# Altium schematic sheet fpga-wing.SchDoc
size A
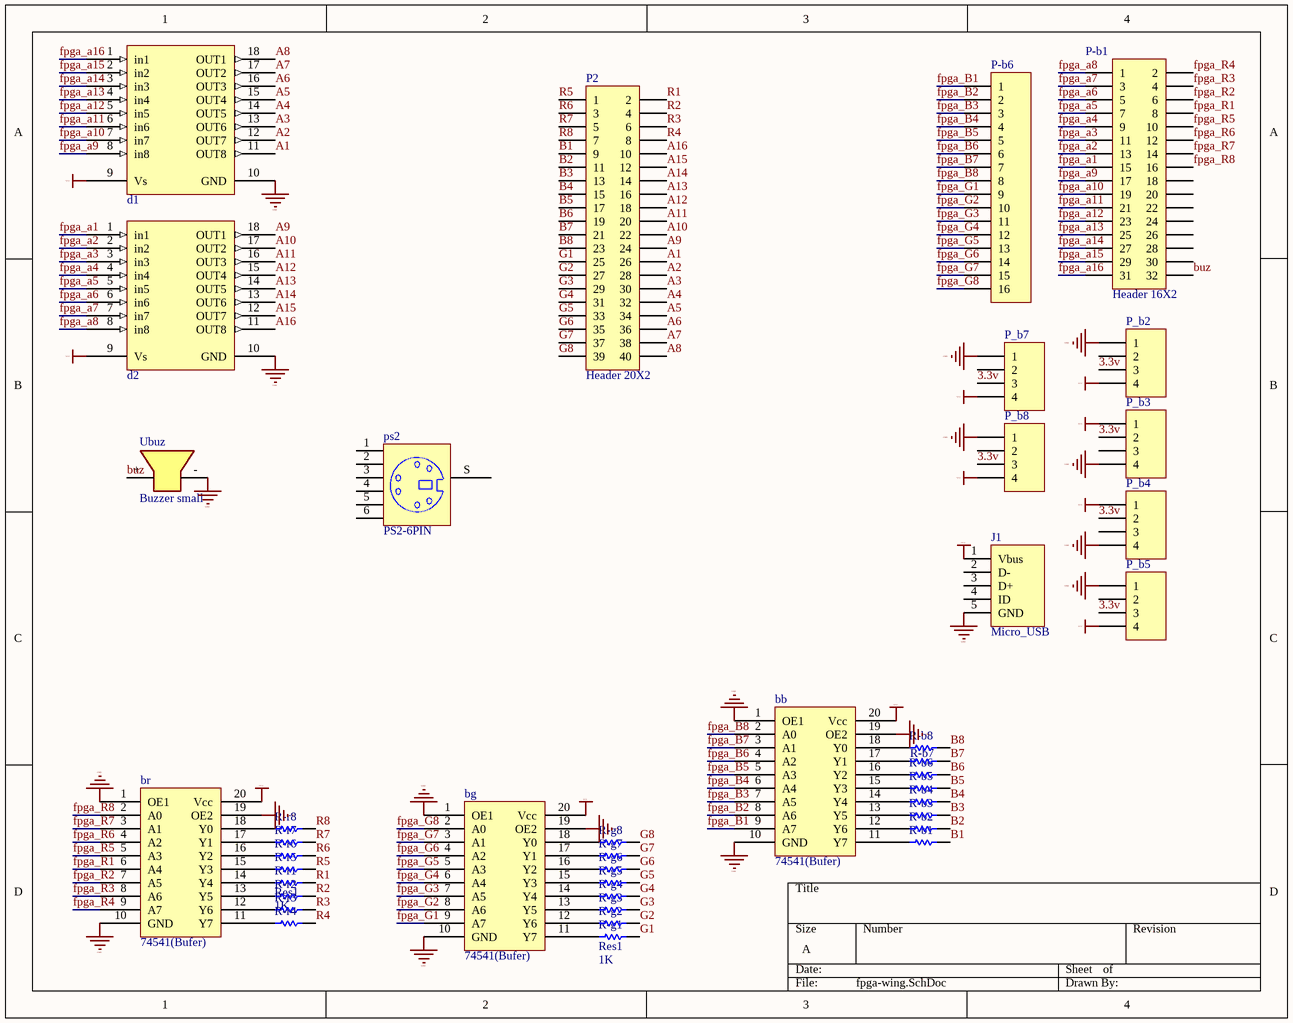
[diagram p0: fpga-wing.SchDoc]

## Parts
bb  74541(Bufer)  [SO20_M]
bg  74541(Bufer)  [SO20_M]
br  74541(Bufer)  [SO20_M]
d1  udn2981  [DIP18]  (value not drawn)
d2  udn2981  [DIP18]  (value not drawn)
J1  Micro_USB  [microUSB]
P2  Header 20X2  [HDR2X20]
P-b1  Header 16X2  [HDR2X16]
P-b6  Header 16  [My_1X16]  (value not drawn)
P_b2  Header 4  [My_1X04]  (value not drawn)
P_b3  Header 4  [My_1X04]  (value not drawn)
P_b4  Header 4  [My_1X04]  (value not drawn)
P_b5  Header 4  [My_1X04]  (value not drawn)
P_b7  Header 4  [My_1X04]  (value not drawn)
P_b8  Header 4  [My_1X04]  (value not drawn)
ps2  PS2-6PIN  [My_PS2-6PIN]
R-b1  Res1  [SMD_RES_1206]  (value not drawn)
R-b2  Res1  [SMD_RES_1206]  (value not drawn)
R-b3  Res1  [SMD_RES_1206]  (value not drawn)
R-b4  Res1  [SMD_RES_1206]  (value not drawn)
R-b5  Res1  [SMD_RES_1206]  (value not drawn)
R-b6  Res1  [SMD_RES_1206]  (value not drawn)
R-b7  Res1  [SMD_RES_1206]  (value not drawn)
R-b8  Res1  [SMD_RES_1206]  (value not drawn)
R-g1  Res1  value 1K  [SMD_RES_1206]
R-g2  Res1  [SMD_RES_1206]  (value not drawn)
R-g3  Res1  [SMD_RES_1206]  (value not drawn)
R-g4  Res1  [SMD_RES_1206]  (value not drawn)
R-g5  Res1  [SMD_RES_1206]  (value not drawn)
R-g6  Res1  [SMD_RES_1206]  (value not drawn)
R-g7  Res1  [SMD_RES_1206]  (value not drawn)
R-g8  Res1  [SMD_RES_1206]  (value not drawn)
R-r1  Res1  value 1K  [SMD_RES_1206]
R-r2  Res1  [SMD_RES_1206]  (value not drawn)
R-r3  Res1  [SMD_RES_1206]  (value not drawn)
R-r4  Res1  [SMD_RES_1206]  (value not drawn)
R-r5  Res1  [SMD_RES_1206]  (value not drawn)
R-r6  Res1  [SMD_RES_1206]  (value not drawn)
R-r7  Res1  [SMD_RES_1206]  (value not drawn)
R-r8  Res1  [SMD_RES_1206]  (value not drawn)
Ubuz  Buzzer small  [My_Buzzer]

## Nets
GND: bb.1(OE1) bb.10(GND) bb.19(OE2) bg.1(OE1) bg.10(GND) bg.19(OE2) br.1(OE1) br.10(GND) br.19(OE2) d1.10(GND) d2.10(GND) J1.5(GND) P_b2.1 P_b3.4 P_b4.4 P_b5.1 P_b7.1 P_b8.1 Ubuz.-
VCC: bb.20(Vcc) bg.20(Vcc) br.20(Vcc) d1.9(Vs) d2.9(Vs) J1.1(Vbus) P_b2.4 P_b3.1 P_b4.1 P_b5.4 P_b7.4 P_b8.4
3.3v: P_b2.3 P_b3.2 P_b4.2 P_b5.3 P_b7.3 P_b8.3
A1: d1.11(OUT8) P2.26
A2: d1.12(OUT7) P2.28
A3: d1.13(OUT6) P2.30
A4: d1.14(OUT5) P2.32
A5: d1.15(OUT4) P2.34
A6: d1.16(OUT3) P2.36
A7: d1.17(OUT2) P2.38
A8: d1.18(OUT1) P2.40
A9: d2.18(OUT1) P2.24
A10: d2.17(OUT2) P2.22
A11: d2.16(OUT3) P2.20
A12: d2.15(OUT4) P2.18
A13: d2.14(OUT5) P2.16
A14: d2.13(OUT6) P2.14
A15: d2.12(OUT7) P2.12
A16: d2.11(OUT8) P2.10
B1: P2.9 R-b1.2
B2: P2.11 R-b2.2
B3: P2.13 R-b3.2
B4: P2.15 R-b4.2
B5: P2.17 R-b5.2
B6: P2.19 R-b6.2
B7: P2.21 R-b7.2
B8: P2.23 R-b8.2
buz: P-b1.32 Ubuz.+
fpga_a1: d2.1(in1) P-b1.15
fpga_a2: d2.2(in2) P-b1.13
fpga_a3: d2.3(in3) P-b1.11
fpga_a4: d2.4(in4) P-b1.9
fpga_a5: d2.5(in5) P-b1.7
fpga_a6: d2.6(in6) P-b1.5
fpga_a7: d2.7(in7) P-b1.3
fpga_a8: d2.8(in8) P-b1.1
fpga_a9: d1.8(in8) P-b1.17
fpga_a10: d1.7(in7) P-b1.19
fpga_a11: d1.6(in6) P-b1.21
fpga_a12: d1.5(in5) P-b1.23
fpga_a13: d1.4(in4) P-b1.25
fpga_a14: d1.3(in3) P-b1.27
fpga_a15: d1.2(in2) P-b1.29
fpga_a16: d1.1(in1) P-b1.31
fpga_B1: bb.9(A7) P-b6.1
fpga_B2: bb.8(A6) P-b6.2
fpga_B3: bb.7(A5) P-b6.3
fpga_B4: bb.6(A4) P-b6.4
fpga_B5: bb.5(A3) P-b6.5
fpga_B6: bb.4(A2) P-b6.6
fpga_B7: bb.3(A1) P-b6.7
fpga_B8: bb.2(A0) P-b6.8
fpga_G1: bg.9(A7) P-b6.9
fpga_G2: bg.8(A6) P-b6.10
fpga_G3: bg.7(A5) P-b6.11
fpga_G4: bg.6(A4) P-b6.12
fpga_G5: bg.5(A3) P-b6.13
fpga_G6: bg.4(A2) P-b6.14
fpga_G7: bg.3(A1) P-b6.15
fpga_G8: bg.2(A0) P-b6.16
fpga_R1: br.6(A4) P-b1.8
fpga_R2: br.7(A5) P-b1.6
fpga_R3: br.8(A6) P-b1.4
fpga_R4: br.9(A7) P-b1.2
fpga_R5: br.5(A3) P-b1.10
fpga_R6: br.4(A2) P-b1.12
fpga_R7: br.3(A1) P-b1.14
fpga_R8: br.2(A0) P-b1.16
G1: P2.25 R-g1.2
G2: P2.27 R-g2.2
G3: P2.29 R-g3.2
G4: P2.31 R-g4.2
G5: P2.33 R-g5.2
G6: P2.35 R-g6.2
G7: P2.37 R-g7.2
G8: P2.39 R-g8.2
R1: P2.2 R-r1.2
R2: P2.4 R-r2.2
R3: P2.6 R-r3.2
R4: P2.8 R-r4.2
R5: P2.1 R-r5.2
R6: P2.3 R-r6.2
R7: P2.5 R-r7.2
R8: P2.7 R-r8.2
Netbb_11: bb.11(Y7) R-b1.1
Netbb_12: bb.12(Y6) R-b2.1
Netbb_13: bb.13(Y5) R-b3.1
Netbb_14: bb.14(Y4) R-b4.1
Netbb_15: bb.15(Y3) R-b5.1
Netbb_16: bb.16(Y2) R-b6.1
Netbb_17: bb.17(Y1) R-b7.1
Netbb_18: bb.18(Y0) R-b8.1
Netbg_11: bg.11(Y7) R-g1.1
Netbg_12: bg.12(Y6) R-g2.1
Netbg_13: bg.13(Y5) R-g3.1
Netbg_14: bg.14(Y4) R-g4.1
Netbg_15: bg.15(Y3) R-g5.1
Netbg_16: bg.16(Y2) R-g6.1
Netbg_17: bg.17(Y1) R-g7.1
Netbg_18: bg.18(Y0) R-g8.1
Netbr_11: br.11(Y7) R-r4.1
Netbr_12: br.12(Y6) R-r3.1
Netbr_13: br.13(Y5) R-r2.1
Netbr_14: br.14(Y4) R-r1.1
Netbr_15: br.15(Y3) R-r5.1
Netbr_16: br.16(Y2) R-r6.1
Netbr_17: br.17(Y1) R-r7.1
Netbr_18: br.18(Y0) R-r8.1

Not connected (* = marked no-connect by the designer): J1 2(D-) 3(D+) 4(ID); P-b1 18 20 22 24 26 28 30; P_b2 2; P_b3 3; P_b4 3; P_b5 2; P_b7 2; P_b8 2; ps2 1 2 3 4 5 6 S

## Library data of the parts
P2 = Header 20X2: Header, 20-Pin, Dual row; LatestRevisionDate: 17-Jul-2002; LatestRevisionNote: Re-released for DXP Platform.; Publisher: Altium Limited
P-b1 = Header 16X2: Header, 16-Pin, Dual row; LatestRevisionDate: 17-Jul-2002; LatestRevisionNote: Re-released for DXP Platform.; Publisher: Altium Limited
P-b6 = Header 16: Header, 16-Pin; LatestRevisionDate: 17-Jul-2002; LatestRevisionNote: Re-released for DXP Platform.; Publisher: Altium Limited
P_b2-P_b5 P_b7 P_b8 = Header 4: Header, 4-Pin; LatestRevisionDate: 17-Jul-2002; LatestRevisionNote: Re-released for DXP Platform.; Publisher: Altium Limited
ps2 = PS2-6PIN: 6 Pin Through Hole PS2 Socket (Kycon P/N); Published: 17-Dec-2003; Publisher: Altium Limited; ComponentLink1Description: Manufacturer Link; ComponentLink1URL: http://www.oupiin.com/prodindx.html#Headers
R-b1-R-b8 R-g2-R-g8 R-r2-R-r8 = Res1: Resistor; Value: 1K; Published: 8-Jun-2000; LatestRevisionDate: 17-Jul-2002; LatestRevisionNote: Re-released for DXP Platform.; PackageReference: AXIAL-0.3; Publisher: Altium Limited; PackageDescription: Axial Device, Thru-Hole; 2 Leads; 0.3 in Pin Spacing
R-g1 R-r1 = Res1: Resistor; Published: 8-Jun-2000; LatestRevisionDate: 17-Jul-2002; LatestRevisionNote: Re-released for DXP Platform.; PackageReference: AXIAL-0.3; Publisher: Altium Limited; PackageDescription: Axial Device, Thru-Hole; 2 Leads; 0.3 in Pin Spacing
Ubuz = Buzzer: 5-12v small buzzer (12mm)